# EAGLE schematic tissuetesterrev3 (EAGLE 6.3)
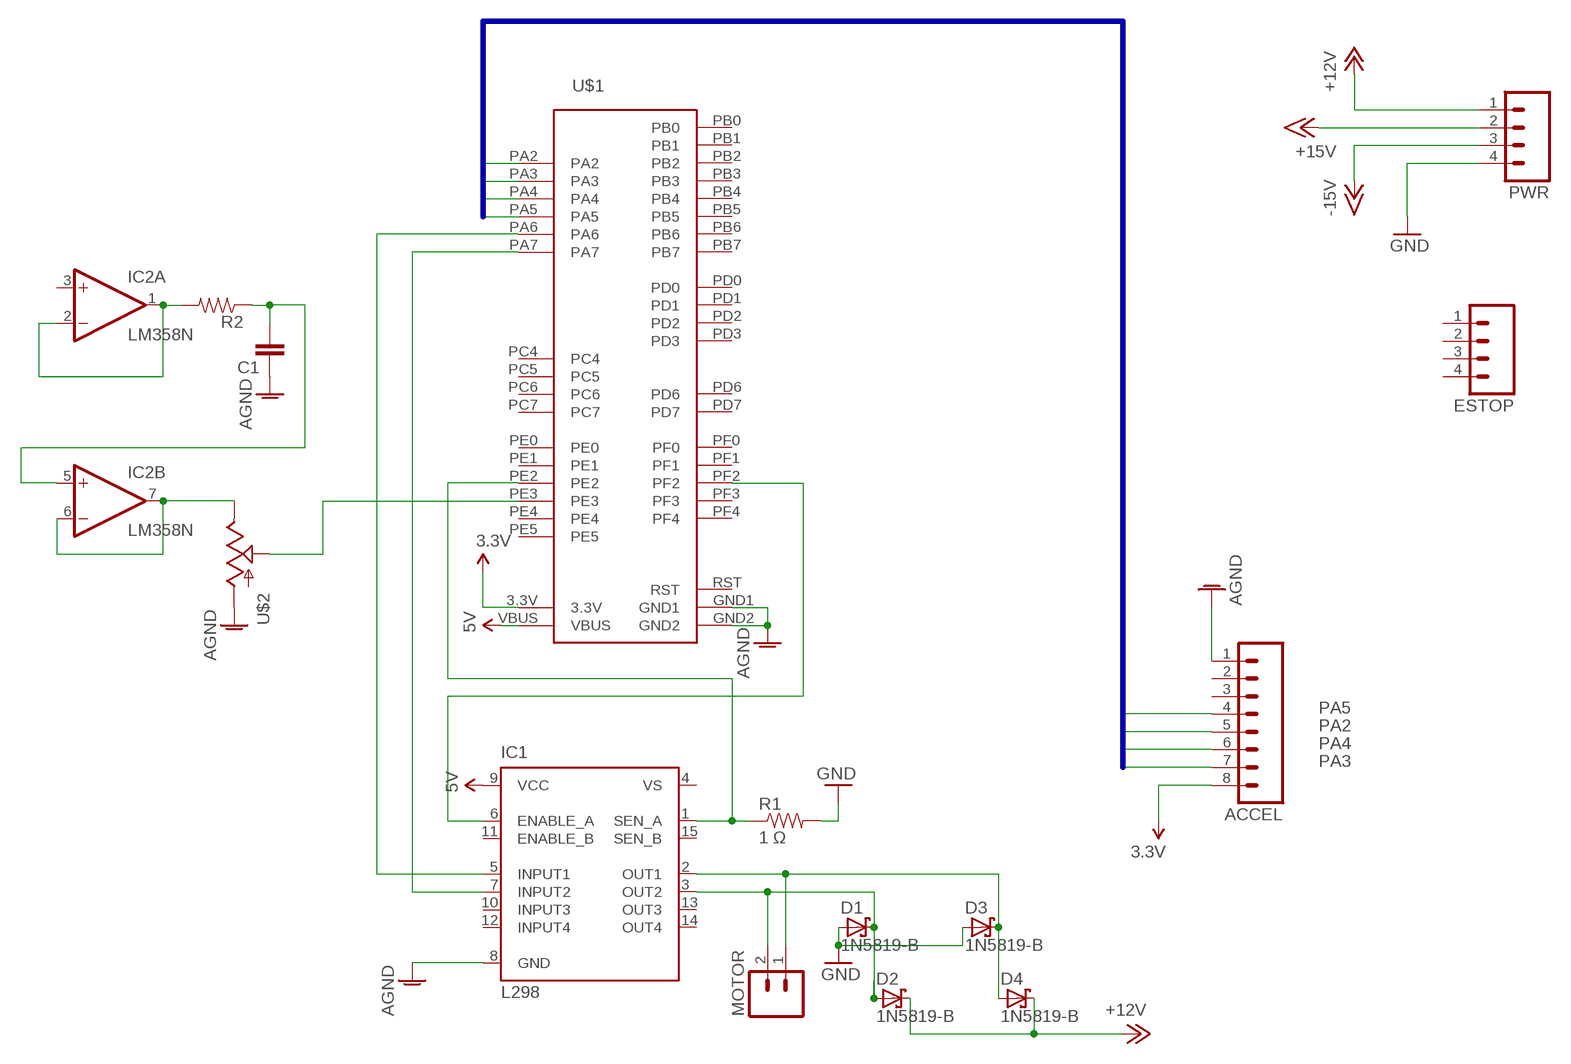
[diagram p0: schematic, sheet 1]

## Parts
ACCEL  M08LOCK  [1X08_LOCK]
C1  CAPKIT  [CAP-PTH-SMALL-KIT]
D1  1N5819-B  [DO41-7.6]
D2  1N5819-B  [DO41-7.6]
D3  1N5819-B  [DO41-7.6]
D4  1N5819-B  [DO41-7.6]
ESTOP  M04LOCK  [1X04_LOCK]
IC1  L298  [MULTIWATT-15]
IC2  LM358N  [DIL08]
MOTOR  M023.5MM  [SCREWTERMINAL-3.5MM-2]
PWR  M04SCREW  [SCREWTERMINAL-3.5MM-4]
R1  1 Ω  RESISTORPTH-1W  [AXIAL-0.6]
R2  RESISTORKIT  [AXIAL-0.3-KIT]
U$1  STELLARIS-LAUNCHPADSTELLARIS-LAUNCHPAD  [LAUNCHPAD-XL]
U$2  POT  [ALPS_POT]

## Nets
3.3V: ACCEL.8 U$1.3.3V
5V: IC1.9(VCC) U$1.VBUS
+12V: D2.C D4.C PWR.1
+15V: PWR.2
-15V: PWR.3
AGND: ACCEL.1 C1.1 IC1.8(GND) U$1.GND1 U$1.GND2 U$2.P$3(A)
GND: D1.A D3.A PWR.4 R1.P$2
N$1: IC1.6(ENABLE_A) U$1.PF2
N$2: IC1.5(INPUT1) U$1.PA6
N$3: IC1.7(INPUT2) U$1.PA7
N$4: IC1.1(SEN_A) R1.P$1 U$1.PE2
N$5: IC2.6(B:-IN) IC2.7(B:OUT) U$2.P$1(E)
N$6: D3.C D4.A IC1.2(OUT1) MOTOR.1
N$7: D1.C D2.A IC1.3(OUT2) MOTOR.2
N$8: IC2.1(A:OUT) IC2.2(A:-IN) R2.P$2
N$9: C1.2 IC2.5(B:+IN) R2.P$1
N$10: U$1.PE3 U$2.P$2(S)
PA2: ACCEL.5 U$1.PA2
PA3: ACCEL.7 U$1.PA3
PA4: ACCEL.6 U$1.PA4
PA5: ACCEL.4 U$1.PA5
Unconnected: ACCEL.2 ACCEL.3 ESTOP.1 ESTOP.2 ESTOP.3 ESTOP.4 IC1.10(INPUT3) IC1.11(ENABLE_B) IC1.12(INPUT4) IC1.13(OUT3) IC1.14(OUT4) IC1.15(SEN_B) IC2.3(A:+IN) U$1.PB0 U$1.PB1 U$1.PB2 U$1.PB3 U$1.PB4 U$1.PB5 U$1.PB6 U$1.PB7 U$1.PC4 U$1.PC5 U$1.PC6 U$1.PC7 U$1.PD0 U$1.PD1 U$1.PD2 U$1.PD3 U$1.PD6 U$1.PD7 U$1.PE0 U$1.PE1 U$1.PE4 U$1.PE5 U$1.PF0 U$1.PF1 U$1.PF3 U$1.PF4

## Buses
PA[2..5]

## Power pins joined to a net without a drawn wire
RST: U$1.RST
V+: IC2.8(P:V+)
V-: IC2.4(P:V-)
VS: IC1.4(VS)

## Library data of the parts
ACCEL = SparkFun-Connectors:M08: Header 8 Standard 8-pin 0.1" header. Use with straight break away headers (SKU : PRT-00116), right angle break away headers (PRT-00553), swiss pins (PRT-00743), machine pins (PRT-00117), and female headers (PRT-00115).
C1 = SparkFun-Capacitors:CAP: Capacitor Standard 0603 ceramic capacitor, and 0.1" leaded capacitor.
D1-D4 = diode:1N581*: 1.0A SCHOTTKY BARRIER RECTIFIER Source: http://www.diodes.com/datasheets/ds23001.pdf
ESTOP PWR = SparkFun-Connectors:M04: Header 4 Standard 4-pin 0.1" header. Use with straight break away headers (SKU : PRT-00116), right angle break away headers (PRT-00553), swiss pins (PRT-00743), machine pins (PRT-00117), and female headers (PRT-00115). Molex polarized connector foot print use with SKU : PRT-08231 with associated crimp pins and housings. 1MM SMD Version SKU: PRT-10208
IC1 = st-microelectronics:L298: DUAL FULL-BRIDGE DRIVER; MPN: L298N; OC_FARNELL: 1589425; OC_NEWARK: 32M1527
IC2 = linear:LM358: OP AMP also LM158; LM258; LM2904 Source: http://cache.national.com/ds/LM/LM158.pdf
MOTOR = SparkFun-Connectors:M02: Header 2 Standard 2-pin 0.1" header. Use with straight break away headers (SKU : PRT-00116), right angle break away headers (PRT-00553), swiss pins (PRT-00743), machine pins (PRT-00117), and female headers (PRT-00115). Molex polarized connector foot print use with SKU : PRT-08233 with associated crimp pins and housings.
R1 = SparkFun-Passives:RESISTOR: Resistor Basic schematic elements and footprints for 0603, 1206, and PTH resistors.
R2 = SparkFun-Resistors:RESISTOR: Resistor Basic schematic elements and footprints for 0603, 1206, and PTH resistors.
U$1 = fabhack:STELLARIS-LAUNCHPAD: Stellaris Launchpad LM4F120 using all header pins to connect to XL booster packs.
U$2 = SparkFun-Electromechanical:POT